# Altium schematic sheet Peripheral.SchDoc: FT601 Circuit
size A; SheetNumber: 1; SheetTotal: 1
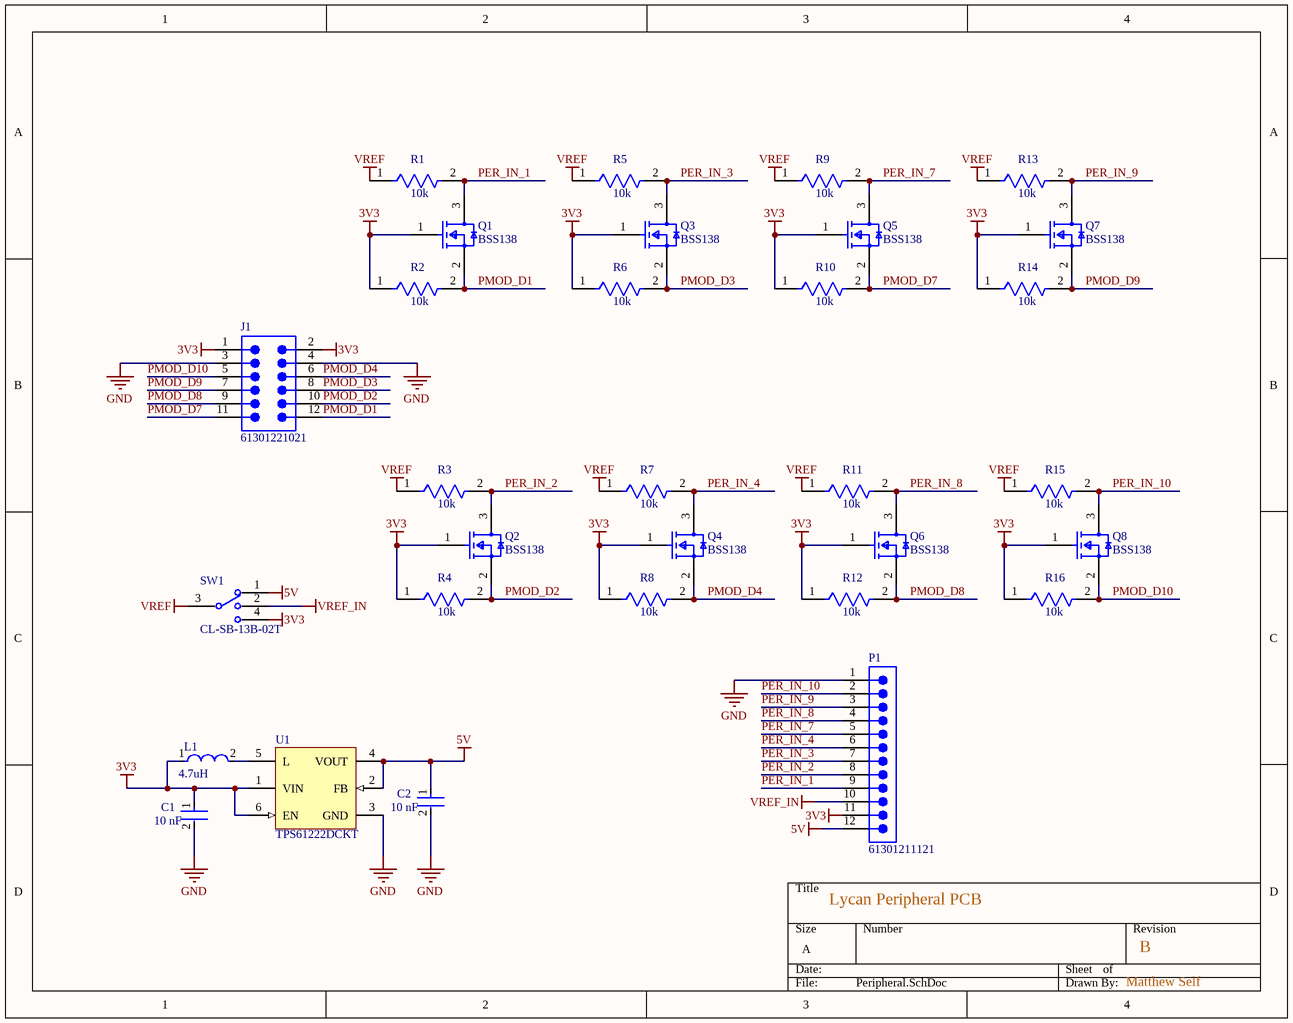
[diagram p0: Peripheral.SchDoc]

## Parts
C1  Capacitance: 10 nF  [FP-CC1206-1_25-MFG]  (hidden comment: CC1206KRX7R9BB103)
C2  Capacitance: 10 nF  [FP-CC1206-1_25-MFG]  (hidden comment: CC1206KRX7R9BB103)
J1  61301221021  [61301221021]
L1  Inductance: 4.7uH  [FP-LQM2HPN_G0-IPC_A]  (hidden comment: LQM2HPN4R7MG0L)
P1  61301211121  [61301211121]
Q1  BSS138  [FP-318-08-IPC_B]
Q2  BSS138  [FP-318-08-IPC_B]
Q3  BSS138  [FP-318-08-IPC_B]
Q4  BSS138  [FP-318-08-IPC_B]
Q5  BSS138  [FP-318-08-IPC_B]
Q6  BSS138  [FP-318-08-IPC_B]
Q7  BSS138  [FP-318-08-IPC_B]
Q8  BSS138  [FP-318-08-IPC_B]
R1  Resistance: 10k  [FP-CR1206-IPC_B]  (hidden comment: CR1206-JW-103ELF)
R2  Resistance: 10k  [FP-CR1206-IPC_B]  (hidden comment: CR1206-JW-103ELF)
R3  Resistance: 10k  [FP-CR1206-IPC_B]  (hidden comment: CR1206-JW-103ELF)
R4  Resistance: 10k  [FP-CR1206-IPC_B]  (hidden comment: CR1206-JW-103ELF)
R5  Resistance: 10k  [FP-CR1206-IPC_B]  (hidden comment: CR1206-JW-103ELF)
R6  Resistance: 10k  [FP-CR1206-IPC_B]  (hidden comment: CR1206-JW-103ELF)
R7  Resistance: 10k  [FP-CR1206-IPC_B]  (hidden comment: CR1206-JW-103ELF)
R8  Resistance: 10k  [FP-CR1206-IPC_B]  (hidden comment: CR1206-JW-103ELF)
R9  Resistance: 10k  [FP-CR1206-IPC_B]  (hidden comment: CR1206-JW-103ELF)
R10  Resistance: 10k  [FP-CR1206-IPC_B]  (hidden comment: CR1206-JW-103ELF)
R11  Resistance: 10k  [FP-CR1206-IPC_B]  (hidden comment: CR1206-JW-103ELF)
R12  Resistance: 10k  [FP-CR1206-IPC_B]  (hidden comment: CR1206-JW-103ELF)
R13  Resistance: 10k  [FP-CR1206-IPC_B]  (hidden comment: CR1206-JW-103ELF)
R14  Resistance: 10k  [FP-CR1206-IPC_B]  (hidden comment: CR1206-JW-103ELF)
R15  Resistance: 10k  [FP-CR1206-IPC_B]  (hidden comment: CR1206-JW-103ELF)
R16  Resistance: 10k  [FP-CR1206-IPC_B]  (hidden comment: CR1206-JW-103ELF)
SW1  CL-SB-13B-02T  [FP-CL-SB-13B-02T-MFG]
U1  TPS61222DCKT  [DCK0006A_N]

## Nets
3V3: C1.1 J1.1 J1.2 L1.1 P1.11 Q1.1(G) Q2.1(G) Q3.1(G) Q4.1(G) Q5.1(G) Q6.1(G) Q7.1(G) Q8.1(G) R2.1 R4.1 R6.1 R8.1 R10.1 R12.1 R14.1 R16.1 SW1.4 U1.1(VIN) U1.6(EN)
5V: C2.1 P1.12 SW1.1 U1.2(FB) U1.4(VOUT)
GND: C1.2 C2.2 J1.3 J1.4 P1.1 U1.3(GND)
VREF: R1.1 R3.1 R5.1 R7.1 R9.1 R11.1 R13.1 R15.1 SW1.3(C)
VREF_IN: P1.10 SW1.2
PER_IN_1: P1.9 Q1.3(D) R1.2
PER_IN_2: P1.8 Q2.3(D) R3.2
PER_IN_3: P1.7 Q3.3(D) R5.2
PER_IN_4: P1.6 Q4.3(D) R7.2
PER_IN_7: P1.5 Q5.3(D) R9.2
PER_IN_8: P1.4 Q6.3(D) R11.2
PER_IN_9: P1.3 Q7.3(D) R13.2
PER_IN_10: P1.2 Q8.3(D) R15.2
PMOD_D1: J1.12 Q1.2(S) R2.2
PMOD_D2: J1.10 Q2.2(S) R4.2
PMOD_D3: J1.8 Q3.2(S) R6.2
PMOD_D4: J1.6 Q4.2(S) R8.2
PMOD_D7: J1.11 Q5.2(S) R10.2
PMOD_D8: J1.9 Q6.2(S) R12.2
PMOD_D9: J1.7 Q7.2(S) R14.2
PMOD_D10: J1.5 Q8.2(S) R16.2
NetL1_2: L1.2 U1.5(L)

## Notes on the sheet
- Lycan Peripheral PCB
- B
- Matthew Self

## Library data of the parts
C1 C2 = CMP-1037-03511-2: CAP CER 10000PF 50V X7R 1206; Manufacturer: Yageo; Automotive Grade: NA; Temperature Coefficient: 15%; Tolerance: 0.1; Description: CC1206 10 nF X7R 10.00%50 V; Value: 10 nF; Material: Ceramic; RoHS: TRUE; Lead Free: Yes; Category: Cap; Temperature Characteristic: X7R; ComponentLink2Description: Datasheet; Device Class L2: Capacitors; Voltage Rating: 50 V; Octopart: https://octopart.com/cc1206krx7r9bb103-yageo-39467800; Temperature Range Low: -55°C; Digikey Description: CAP CER 10000PF 50V X7R 1206; ComponentLink2URL: http://www.yageo.com/documents/recent/UPY-NP0X7R_HV_1KV-to-3KV_11.pdf; Package: CC1206-1.25; Height: 1.45mm; Automotive: No; Mouser Description: Multilayer Ceramic Capacitors MLCC - SMD/SMT 10nF 50V X7R 10%; Temperature Range High: +125°C; Manufacturer Part Number: CC1206KRX7R9BB103; Device Class L3: Ceramic Capacitors; Temperature: -55°C to +125°C; Footprint Url: http://www.yageo.com/exep/pages/download/literatures/UPY-C_GEN_24.pdf; Device Class L1: Passive Components
J1 = CMP-1502-01087-3: NexarPartId: 32855539; Contact Resistance: 20mΩ; Connector Type: Male Pin; Row Spacing: 2.54mm; Number of Positions: 12; Current Rating: 3A; Operating Supply Voltage: 250V; Gender: Male; REACH SVHC: Unknown; Lead Pitch: 2.54mm; Termination: Solder; Color: Black; Contact Mating Length: 5.9944mm; Number of Pins: 12; Number of Rows: 2; Contact Plating: Gold; Mount: Through Hole; Pitch: 2.54mm; Packaging: Bulk; RoHS: Compliant; Number of Contacts: 12; Contact Material: Copper
L1 = CMP-06042-016771-1: Multilayer Type Inductor for Power Lines, 1008 (2520), 4.7μH, 20%, 0.138Ω, 1.1A; Shielding: Shielded; DC Resistance (DCR): 110mR; Core Material: Ferrite; Test Frequency: 1MHz; Self Resonant Frequency: 25MHz; Max DC Current: 1.1A; REACH SVHC: No SVHC; Series: LQM2HP_G0; Case Code (Metric): 2520; Current Rating: 1.1A; Packaging: Tape and Reel; Tolerance: 20%; Military Standard: Not; Min Operating Temperature: -55°C; RoHS Compliant: Yes; Width: 0.079inch; Depth: 2.2mm; Max Operating Temperature: 125°C; Package Quantity: 3000; Mount: Surface Mount; Termination: SMD/SMT; Height: 1.2mm; Case/Package: 1008; Rated Current-Max: 1.1A; Height - Seated (Max): 0.039inch; Case Code (Imperial): 1008; Radiation Hardening: No; Lead Free: Lead Free; DC Current: 1.1A; Length: 2.5mm; Inductance Tolerance: 20%
P1 = CMP-1502-01086-3: NexarPartId: 32855538; Contact Resistance: 20mΩ; Current Rating: 3A; Operating Supply Voltage: 250V; Number of Positions: 12; Connector Type: Male Pin; Gender: Male; Pitch: 2.54mm; Number of Pins: 12; Mount: Through Hole; Color: Black; RoHS: Compliant; Contact Plating: Gold; Contact Material: Copper; Packaging: Bulk; Orientation: Vertical; Number of Contacts: 12; Termination: Solder; Contact Mating Length: 5.9944mm; Lead Pitch: 2.54mm; REACH SVHC: Unknown; Number of Rows: 1
Q1-Q8 = CMP-07173-000101-1: MOSFET N-CH 50V 220MA SOT-23; Turn-Off Delay Time: 20ns; Element Configuration: Single; Rds On Max: 3.5R; Gate to Source Voltage (Vgs): 20V; Threshold Voltage: 1.3V; Number of Elements: 1; Power Dissipation: 360mW; Rise Time: 9ns; Turn-On Delay Time: 2.5ns; Input Capacitance: 27pF; On-State Resistance: 6R; Lead Free: Lead Free; Length: 2.92mm; Width: 1.3mm; Drain to Source Breakdown Voltage: 50V; Min Operating Temperature: -55°C; REACH SVHC: No SVHC; Packaging: Tape and Reel; Radiation Hardening: No; Height: 0.93mm; Drain to Source Voltage (Vdss): 50V; Current Rating: 220mA; Voltage Rating (DC): 50V; Weight: 0.03g; Continuous Drain Current (ID): 220mA; Number of Pins: 3; Nominal Vgs: 1.3V; Max Power Dissipation: 360mW; Fall Time: 9ns; Drain to Source Resistance: 3.5R; Contact Plating: Tin; Case/Package: SOT-23; Package Quantity: 1; Dual Supply Voltage: 50V; Mount: Surface Mount; Termination: SMD/SMT; Max Operating Temperature: 150°C
R1-R16 = CMP-07231-005593-1: Thick Film Chip Resistors 1206 10kΩ 0.25W 5% 200ppm/°C; Voltage Rating: 200V; Max Power Dissipation: 250mW; Temperature Coefficient: 200ppm/°C; Height: 0.6mm; Case Code (Imperial): 1206; REACH SVHC: No SVHC; Depth: 1.6mm; Mount: Surface Mount; Termination: SMD/SMT; Case/Package: 1206; Min Operating Temperature: -55°C; Features: Moisture Resistant; Number of Pins: 2; Length: 3.2mm; Military Standard: Not; Radiation Hardening: No; Max Operating Temperature: 155°C; Power Rating: 250mW; Case Code (Metric): 3216; Package Quantity: 1; Composition: Thick Film; Tolerance: 5%; Voltage Rating (DC): 200V; Contact Plating: Tin; Thickness: 610um; Number of Terminations: 2; Packaging: Tape and Reel; Width: 1.6mm
SW1 = CMP-08360-77011255-1: CL-SB-13B-02T Switch Slide ON-ON-ON SP3T Top 200mA 12VDC 10000Cycles Gullwing T/R; Actuator Length: 2mm; Contact Style: Non-Shorting; Electrical Life: 10kcycles; Contact Resistance: 70mΩ; Voltage Rating (DC): 12V; Actuator Material: Nylon, Polyamide; RoHS: Compliant; Contact Current Rating: 200mA; Packaging: Tape & Reel (TR); Termination: Gull Wing; Orientation: Vertical; Lead Free: Lead Free; Current Rating: 200mA; Mount: Surface Mount; Height: 6.1mm; Switch Travel: 2mm; Switch Function: On-On-On; Contact Plating: Gold; Min Operating Temperature: -40°C; Throw Configuration: SP3T; Life (Cycles): 10kcycles; NexarPartId: 77011255; Contact Material: Copper; Max Operating Temperature: 85°C
U1 = CMP-0343-00079-2: Boost Voltage Converter with 0.7 to 5.5 V Input and 5 V Output, -40 to 85 degC, 6-Pin SC70 (DCK), Green (RoHS & no Sb/Br); Manufacturer: Texas Instruments; Vin(Min)(V): 0.7; Vout(Max)(V): 5; SubFamily: Step-Up Regulator; Regulated Outputs(#): 1; Vin(Max)(V): 5.5; Switching Frequency(Max)(kHz): 2000; Eco-Plan: Green (RoHS & no Sb/Br); ComponentLink1URL: http://www.ti.com/general/docs/lit/getliterature.tsp?genericPartNumber=TPS61222&fileType=pdf; Topology: Boost; Code_JEDEC: MO-203-AB; DatasheetVersion: SLVS776; ComponentLink2Description: Package Specification; ComponentLink1Description: Datasheet; PackageVersion: revG, Jan-2007; PackageDescription: 6-Pin Plastic Small-Outline Package, 2 x 1.3 mm Body, 0.65 mm Pitch, 2.1 mm Lead Span; Vout(Min)(V): 5; ComponentLink2URL: http://www.ti.com/litv/pdf/mpds114c; PackageReference: DCK0006A; Mounting Technology: Surface Mount; PartNumber: TPS61222DCKT